# Altium schematic sheet 4.STM32.SchDoc
size A3; SheetNumber: 4; SheetTotal: 5
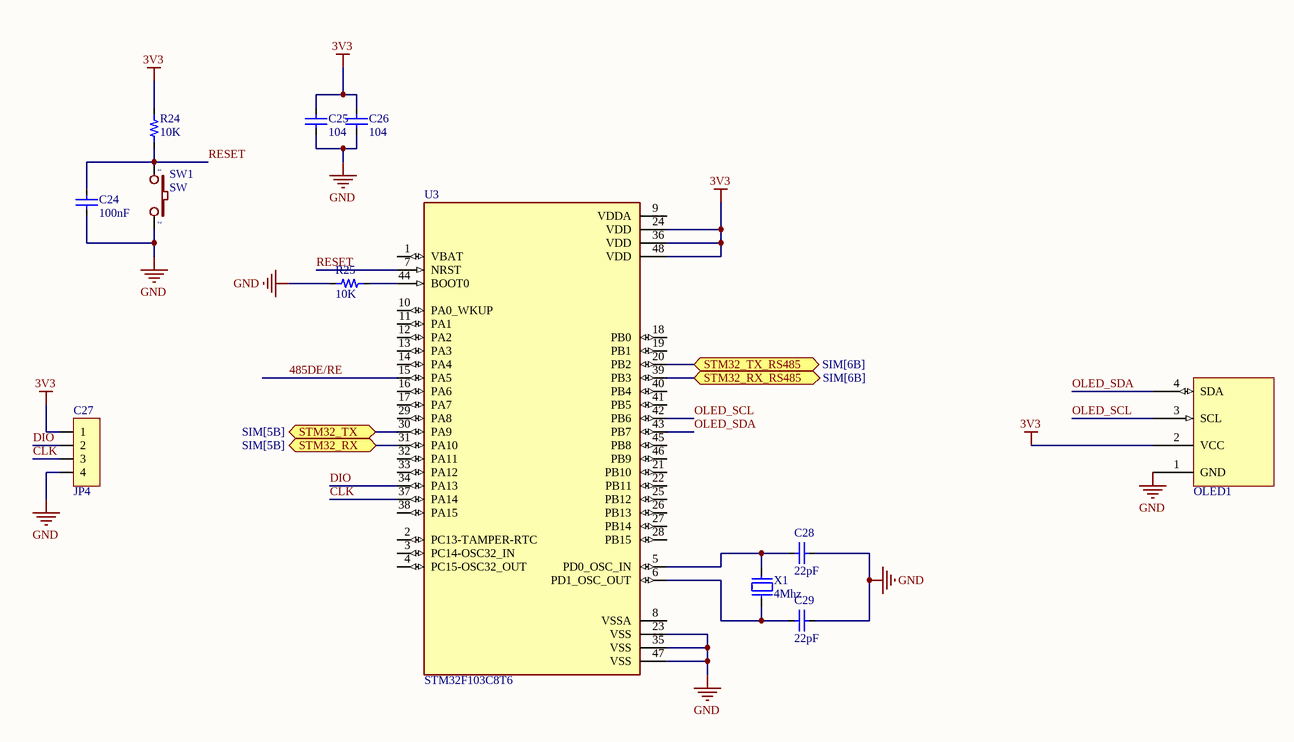
[diagram p0: 4.STM32.SchDoc]

## Parts
C24  100nF  [CAP_0805]
C25  104  [CAP_0805]
C26  104  [CAP_0805]
C27  JP4  [JP4-C1T]
C28  22pF  [CAP_0805]
C29  22pF  [CAP_0805]
OLED1  SSD1306  [OLED 1.3]  (value not drawn)
R24  10K  [RES-SMD-0101]
R25  10K  [RES-SMD-0101]
SW1  SW  [SW2]
U3  STM32F103C8T6  [STM32F103C8T6]
X1  4Mhz  [XT2]

## Ports
STM32_RX (bidir, see SIM[5B]), STM32_RX_RS485 (bidir, see SIM[6B]), STM32_TX (bidir, see SIM[5B]), STM32_TX_RS485 (bidir, see SIM[6B])

## Nets
3V3: C25.1 C26.1 C27.1 OLED1.2(VCC) R24.1 U3.24(VDD) U3.36(VDD) U3.48(VDD)
GND: C24.2 C25.2 C26.2 C27.4 C28.1 C29.1 OLED1.1(GND) R25.1 SW1.2 U3.23(VSS) U3.35(VSS) U3.47(VSS)
485DE/RE: U3.15(PA5)
CLK: C27.3 U3.37(PA14)
DIO: C27.2 U3.34(PA13)
OLED_SCL: OLED1.3(SCL) U3.42(PB6)
OLED_SDA: OLED1.4(SDA) U3.43(PB7)
RESET: C24.1 R24.2 SW1.1 U3.7(NRST)
STM32_RX: U3.31(PA10) ; port STM32_RX
STM32_RX_RS485: U3.39(PB3) ; port STM32_RX_RS485
STM32_TX: U3.30(PA9) ; port STM32_TX
STM32_TX_RS485: U3.20(PB2) ; port STM32_TX_RS485
NetC28_2: C28.2 U3.5(PD0_OSC_IN) X1.2
NetC29_2: C29.2 U3.6(PD1_OSC_OUT) X1.1
NetR25_2: R25.2 U3.44(BOOT0)

Not connected (* = marked no-connect by the designer): U3 1(VBAT) 2(PC13-TAMPER-RTC) 3(PC14-OSC32_IN) 4(PC15-OSC32_OUT) 8(VSSA) 9(VDDA) 10(PA0_WKUP) 11(PA1) 12(PA2) 13(PA3) 14(PA4) 16(PA6) 17(PA7) 18(PB0) 19(PB1) 21(PB10) 22(PB11) 25(PB12) 26(PB13) 27(PB14) 28(PB15) 29(PA8) 32(PA11) 33(PA12) 38(PA15) 40(PB4) 41(PB5) 45(PB8) 46(PB9)

## Library data of the parts
C24-C26 C28 C29 = CapSMD: Capacitor; Value: 33p; Published: 8-Jun-2000; LatestRevisionDate: 17-Jul-2002; LatestRevisionNote: Re-released for DXP Platform.; PackageReference: RAD-0.3; Publisher: Altium Limited
C27 = JP4: WR-PHD 2.54 mm Angled Socket Header; Manufacturer: W¨¹rth Elektronik eiSos GmbH; partNo: 613004143121; ComponentLink1 Description: Manufacturer; ComponentLink2 Description: Datasheet; NoPins: 04; Created Date: 29 March 2013; ComponentLink1URL: http://www.we-online.com; ComponentLink2URL: http://katalog.we-online.de/em/datasheet/6130xx143121.pdf; Created by: Karrer Zheng
OLED1 = OLED 1.3": OLED 1.3" SSD1306
R24 R25 = Resistor - SMD: Resistor; Manufacturer: Generic Components; Class: Passive; Published: 08/06/2000; Publisher: Altium Hobart Technology Centre
SW1 = SW2: Switch button 2 pin; Value: SW chip 2 pin
U3 = STM32F103C8T6: Mainstream Performance line, ARM Cortex-M3 MCU with 64 Kbytes Flash, 72 MHz CPU, motor control, USB and CAN
X1 = XT2: Crystal For all Crystal 2pin.; Value: 4Mhz